# EAGLE design led_analog_watch_mvmt_v1_2 (EAGLE 6.2)
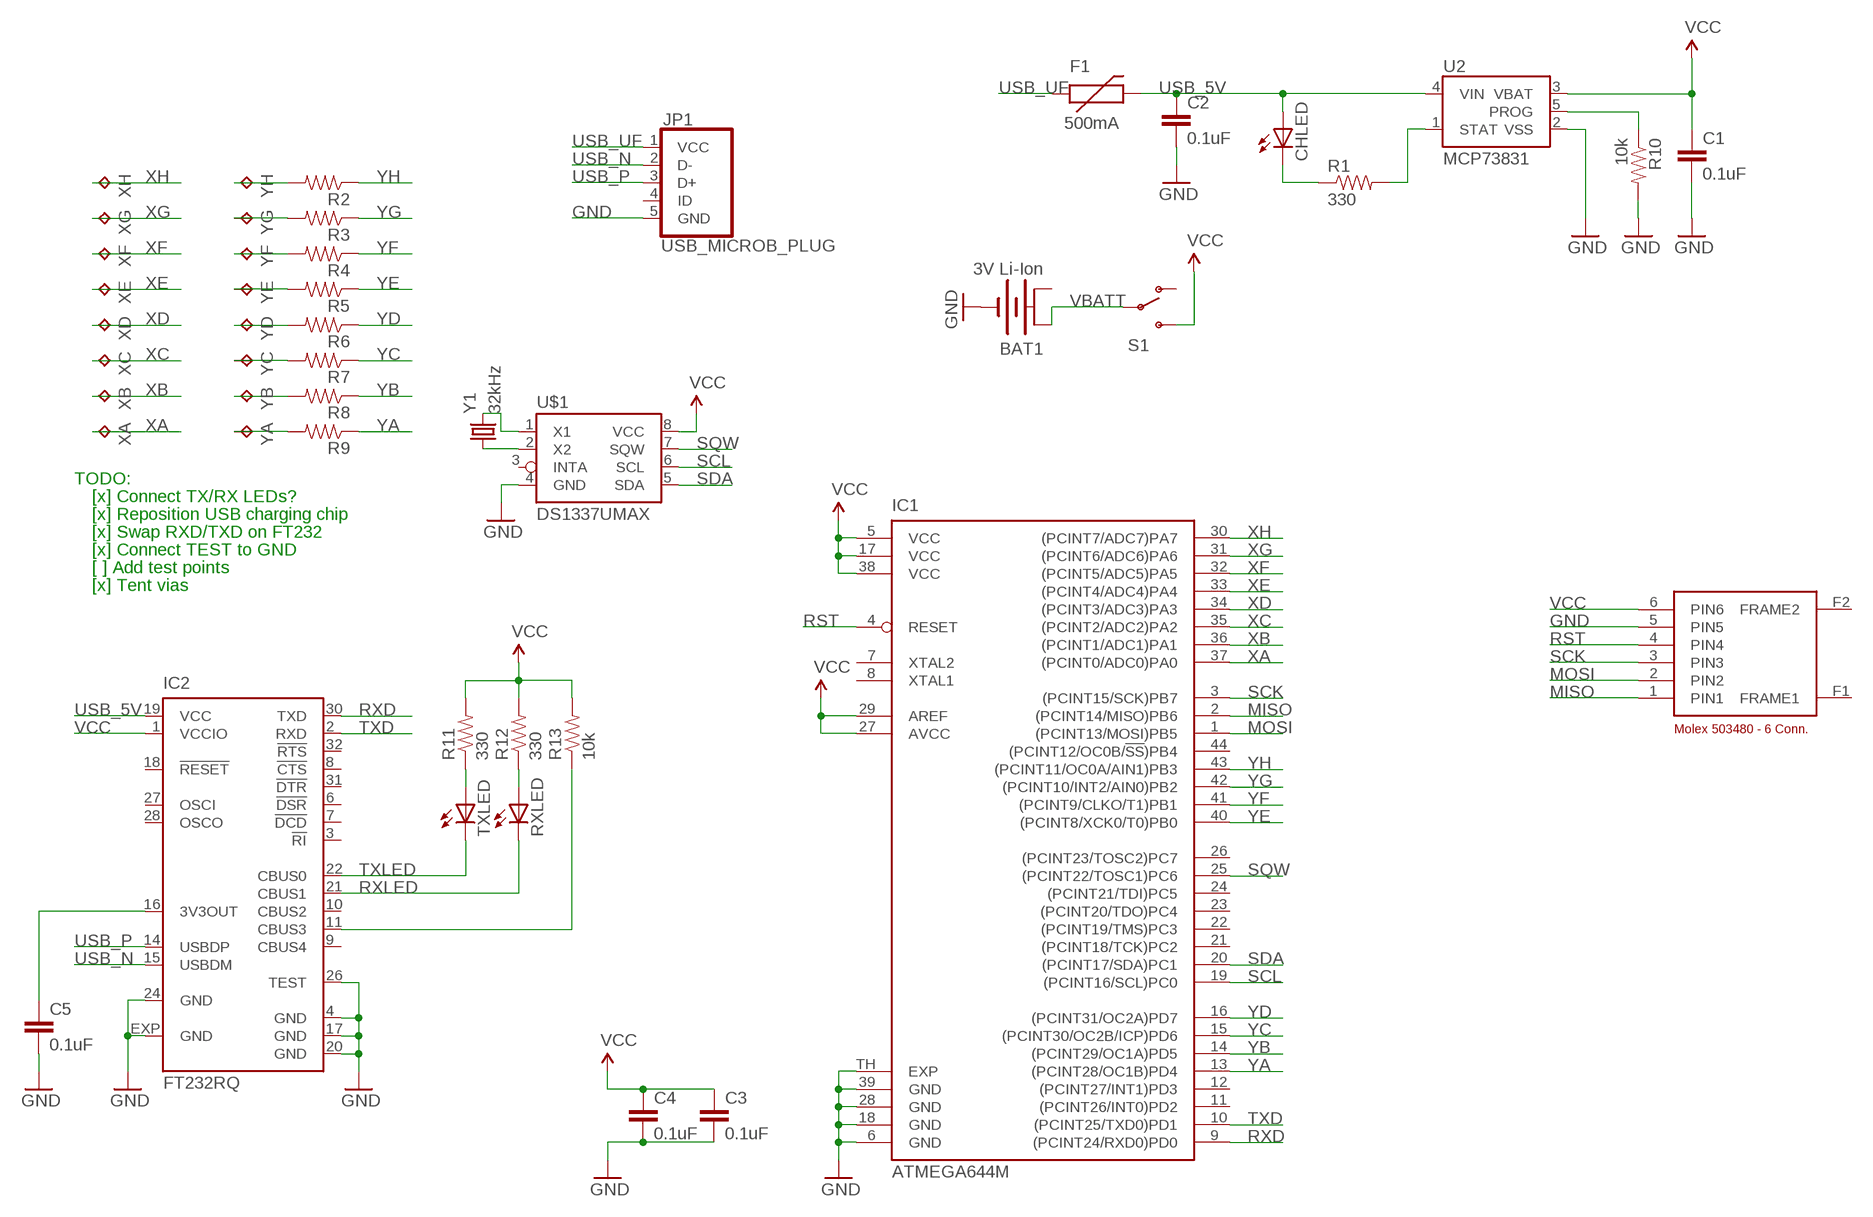
[diagram p0: schematic, sheet 1]

## Parts
BAT1  3V Li-Ion  BATTERY245PTH  [BATTCON_245MM_PTH]
C1  0.1uF  CAP-0603  [0603-CAP]
C2  0.1uF  CAP-0603  [0603-CAP]
C3  0.1uF  CAP-0603  [0603-CAP]
C4  0.1uF  CAP-0603  [0603-CAP]
C5  0.1uF  CAP-0603  [0603-CAP]
CHLED  LED-0402  [0402]
F1  500mA  PTC0603  [0603]
IC1  ATMEGA644M  [MLF44-TH]
IC2  FT232RQ  [QFN32]
JP1  USB_MICROB_PLUG  [USB_MICRO_B_TYCO]
R1  330  RESISTOR-0603  [0603]
R2  RESISTOR-0603  [0603]
R3  RESISTOR-0603  [0603]
R4  RESISTOR-0603  [0603]
R5  RESISTOR-0603  [0603]
R6  RESISTOR-0603  [0603]
R7  RESISTOR-0603  [0603]
R8  RESISTOR-0603  [0603]
R9  RESISTOR-0603  [0603]
R10  10k  RESISTOR-0603  [0603]
R11  330  RESISTOR-0603  [0603]
R12  330  RESISTOR-0603  [0603]
R13  10k  RESISTOR-0603  [0603]
RXLED  LED-0402  [0402]
S1  SWITCH-SPSTMA12R  [SWITCH-MA12R]
TXLED  LED-0402  [0402]
U2  MCP73831  [SOT23-5]
U$1  DS1337UMAX  [UMAX8]
U$2  MOLEX_503480  [MOLEX_503480]
XA  TPTP20R  [TP20R]
XB  TPTP20R  [TP20R]
XC  TPTP20R  [TP20R]
XD  TPTP20R  [TP20R]
XE  TPTP20R  [TP20R]
XF  TPTP20R  [TP20R]
XG  TPTP20R  [TP20R]
XH  TPTP20R  [TP20R]
Y1  32kHz  CRYSTALABS10  [CRYSTAL-ABS10-SMD]
YA  TPTP20R  [TP20R]
YB  TPTP20R  [TP20R]
YC  TPTP20R  [TP20R]
YD  TPTP20R  [TP20R]
YE  TPTP20R  [TP20R]
YF  TPTP20R  [TP20R]
YG  TPTP20R  [TP20R]
YH  TPTP20R  [TP20R]

## Nets
GND: BAT1.2(-) C1.2 C2.2 C3.2 C4.2 C5.2 IC1.6(GND) IC1.18(GND) IC1.28(GND) IC1.39(GND) IC1.TH(EXP) IC2.4(GND) IC2.17(GND) IC2.20(GND) IC2.24(GND) IC2.26(TEST) IC2.EXP(GND) JP1.5(GND) R10.2 U2.2(VSS) U$1.4(GND) U$2.5(PIN5)
MISO: IC1.2((PCINT14/MISO)PB6) U$2.1(PIN1)
MOSI: IC1.1((PCINT13/MOSI)PB5) U$2.2(PIN2)
N$1: R1.2 U2.1(STAT)
N$2: R10.1 U2.5(PROG)
N$3: R2.2 YH.TP
N$4: R3.2 YG.TP
N$5: R4.2 YF.TP
N$6: R5.2 YE.TP
N$7: R6.2 YD.TP
N$8: R7.2 YC.TP
N$9: R8.2 YB.TP
N$10: R9.2 YA.TP
N$11: CHLED.2(C) R1.1
N$12: IC2.11(CBUS3) R13.1
N$13: R12.1 RXLED.1(A)
N$14: U$1.2(X2) Y1.X1
N$15: U$1.1(X1) Y1.X2
N$16: R11.1 TXLED.1(A)
N$18: C5.1 IC2.16(3V3OUT)
RST: IC1.4(RESET) U$2.4(PIN4)
RXD: IC1.9((PCINT24/RXD0)PD0) IC2.30(TXD)
RXLED: IC2.21(CBUS1) RXLED.2(C)
SCK: IC1.3((PCINT15/SCK)PB7) U$2.3(PIN3)
SCL: IC1.19((PCINT16/SCL)PC0) U$1.6(SCL)
SDA: IC1.20((PCINT17/SDA)PC1) U$1.5(SDA)
SQW: IC1.25((PCINT22/TOSC1)PC6) U$1.7(SQW)
TXD: IC1.10((PCINT25/TXD0)PD1) IC2.2(RXD)
TXLED: IC2.22(CBUS0) TXLED.2(C)
USB_5V: C2.1 CHLED.1(A) F1.2 IC2.19(VCC) U2.4(VIN)
USB_N: IC2.15(USBDM) JP1.2(D-)
USB_P: IC2.14(USBDP) JP1.3(D+)
USB_UF: F1.1 JP1.1(VCC)
VBATT [supply]: BAT1.3(+A) S1.2(P)
VCC: C1.1 C3.1 C4.1 IC1.5(VCC) IC1.17(VCC) IC1.27(AVCC) IC1.29(AREF) IC1.38(VCC) IC2.1(VCCIO) R11.2 R12.2 R13.2 S1.3(S) U2.3(VBAT) U$1.8(VCC) U$2.6(PIN6)
XA: IC1.37((PCINT0/ADC0)PA0) XA.TP
XB: IC1.36((PCINT1/ADC1)PA1) XB.TP
XC: IC1.35((PCINT2/ADC2)PA2) XC.TP
XD: IC1.34((PCINT3/ADC3)PA3) XD.TP
XE: IC1.33((PCINT4/ADC4)PA4) XE.TP
XF: IC1.32((PCINT5/ADC5)PA5) XF.TP
XG: IC1.31((PCINT6/ADC6)PA6) XG.TP
XH: IC1.30((PCINT7/ADC7)PA7) XH.TP
YA: IC1.13((PCINT28/OC1B)PD4) R9.1
YB: IC1.14((PCINT29/OC1A)PD5) R8.1
YC: IC1.15((PCINT30/OC2B/ICP)PD6) R7.1
YD: IC1.16((PCINT31/OC2A)PD7) R6.1
YE: IC1.40((PCINT8/XCK0/T0)PB0) R5.1
YF: IC1.41((PCINT9/CLKO/T1)PB1) R4.1
YG: IC1.42((PCINT10/INT2/AIN0)PB2) R3.1
YH: IC1.43((PCINT11/OC0A/AIN1)PB3) R2.1
Unconnected: IC1.7(XTAL2) IC1.8(XTAL1) IC1.11((PCINT26/INT0)PD2) IC1.12((PCINT27/INT1)PD3) IC1.21((PCINT18/TCK)PC2) IC1.22((PCINT19/TMS)PC3) IC1.23((PCINT20/TDO)PC4) IC1.24((PCINT21/TDI)PC5) IC1.26((PCINT23/TOSC2)PC7) IC1.44((PCINT12/OC0B/!SS!)PB4) IC2.3(!RI) IC2.6(!DSR) IC2.7(!DCD) IC2.8(!CTS) IC2.9(CBUS4) IC2.10(CBUS2) IC2.18(!RESET) IC2.27(OSCI) IC2.28(OSCO) IC2.31(!DTR) IC2.32(!RTS) JP1.4(ID) S1.1(O) U$1.3(INTA) U$2.F1(FRAME1) U$2.F2(FRAME2)

## Notes on the sheet
- TODO:
- [x] Connect TX/RX LEDs?
- [x] Reposition USB charging chip
- [x] Swap RXD/TXD on FT232
- [x] Connect TEST to GND
- [ ] Add test points
- [x] Tent vias

## Power pins joined to a net without a drawn wire
+B: BAT1.1(+B)

## Library data of the parts
BAT1 = jcole:BATTERY: Battery Holders Various common sizes : AA, AAA, 20mm coin cell and 12mm coin cell.
C1-C5 = jcole:CAP: Capacitor Standard 0603 ceramic capacitor, and 0.1" leaded capacitor.
CHLED RXLED TXLED = jcole:LED: LEDs Standard schematic elements and footprints for 5mm, 3mm, 1206, and 0603 sized LEDs. 5mm - Spark Fun Electronics SKU : COM-00529 (and others)
F1 = SparkFun:PTC: Resettable Fuse PTC Resettable Fuse. Spark Fun Electronics SKU : COM-08357
IC1 = atmel:ATMEGA644*: 8-bit Microcontroller with 64K Bytes In-System Programmable Flash Source: http://www.atmel.com/dyn/resources/prod_documents/doc2593.pdf; MPN: ATMEGA644P-20MU; OC_FARNELL: 1748528; OC_NEWARK: 26R5636
IC2 = jcole:FT232R: Source: http://www.ftdichip.com/Documents/DataSheets/DS_FT232R_v104.pdf; MPN: FT232RQ; OC_FARNELL: 1146033; OC_NEWARK: 91K9919
JP1 = jcole:USB_MICROB_PLUG: USB Micro-B Plug Comes in a variety of packages. Check out Hirose's ZX-x0 line: http://www.hirose.co.jp/cataloge_hp/e24200011.pdf
R1-R13 = jcole:RESISTOR: Resistor Basic schematic elements and footprints for 0603, 1206, and PTH resistors.
S1 = jcole:SWITCH-SPST: SPST Switch Simple slide switch. Spark Fun Electronics SKU : COM-00102
U2 = SparkFun:MCP73831: Microchip's MCP73831 Miniature single cell, fully integrated Li-Ion, Li-polymer charge management controller http://ww1.microchip.com/downloads/en/DeviceDoc/21984a.pdf
U$1 = jcole:DS1337
U$2 = jcole:MOLEX_503480
XA XB XC XD XE XF XG XH YA YB YC YD YE YF YG YH = testpad:TP: Test pad
Y1 = jcole:CRYSTAL: Crystals Various standard crystals. Proven footprints. Spark Fun Electronics SKU : COM-00534

## Net classes
0 signal: width 0.203 mm
1 supply: width 0.305 mm

## Board
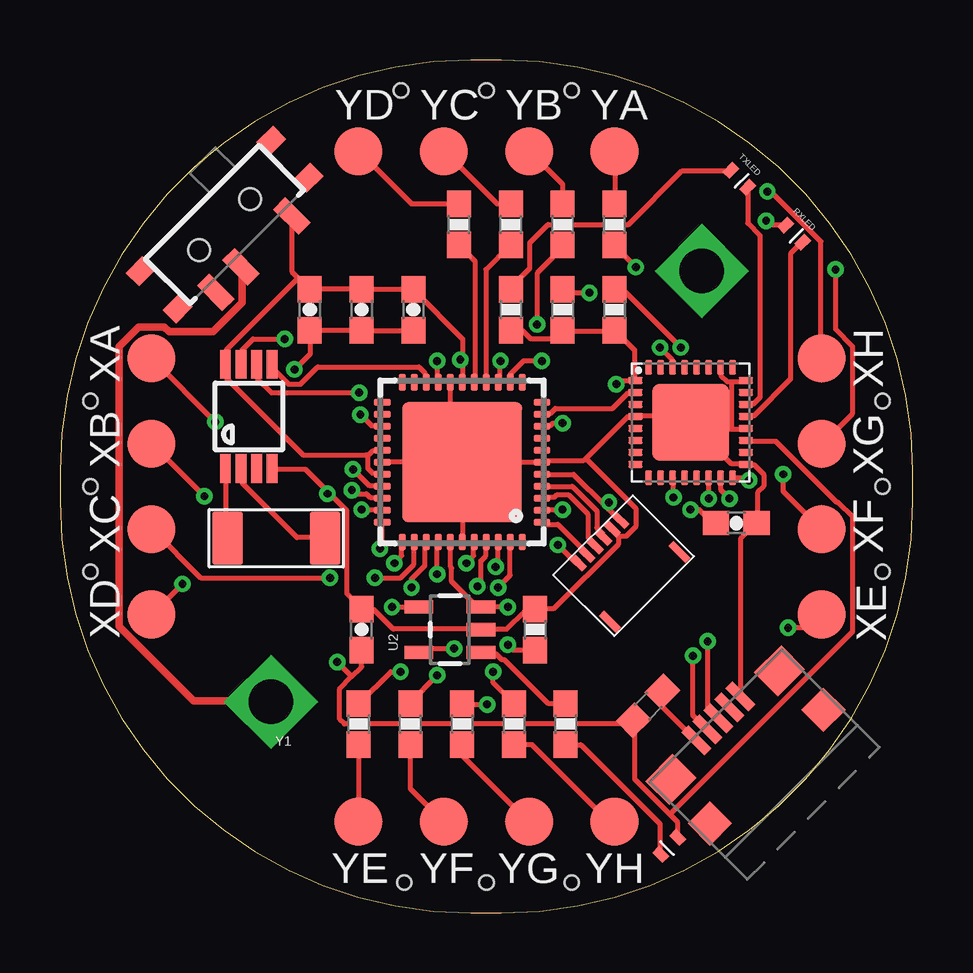
[diagram p1: board, top side]
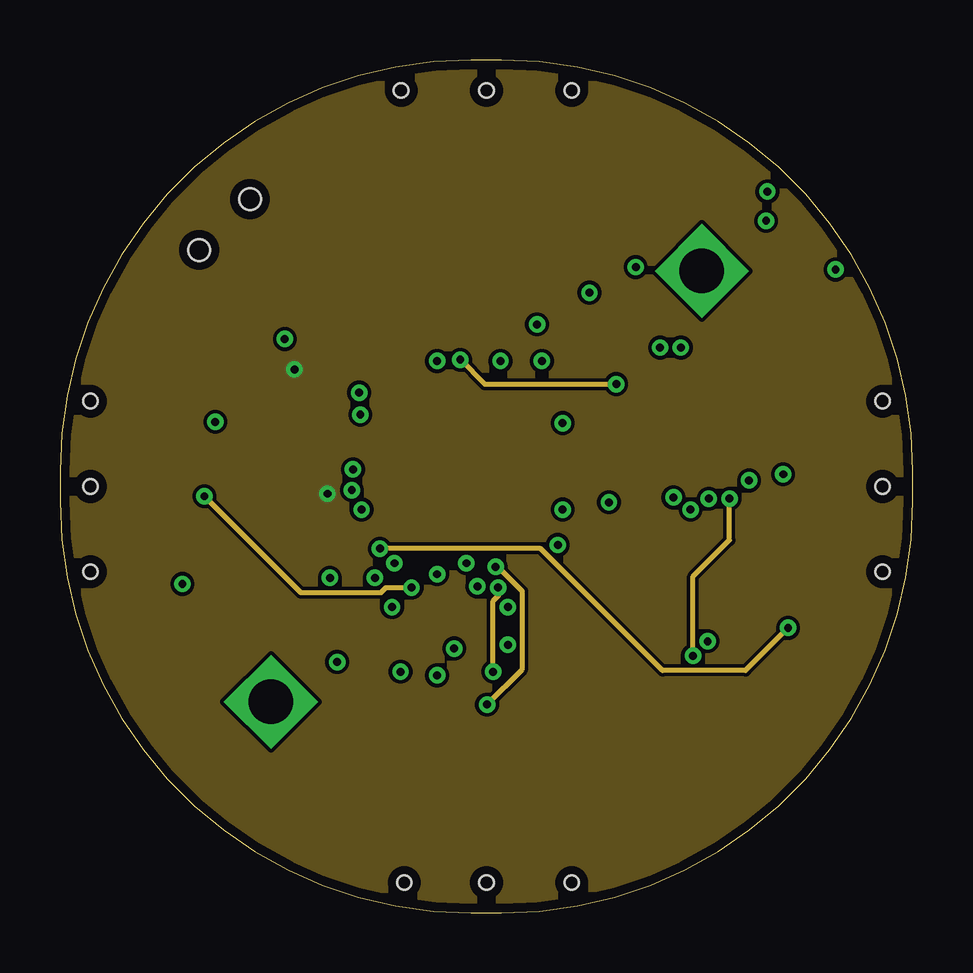
[diagram p2: board, inner layer GND]
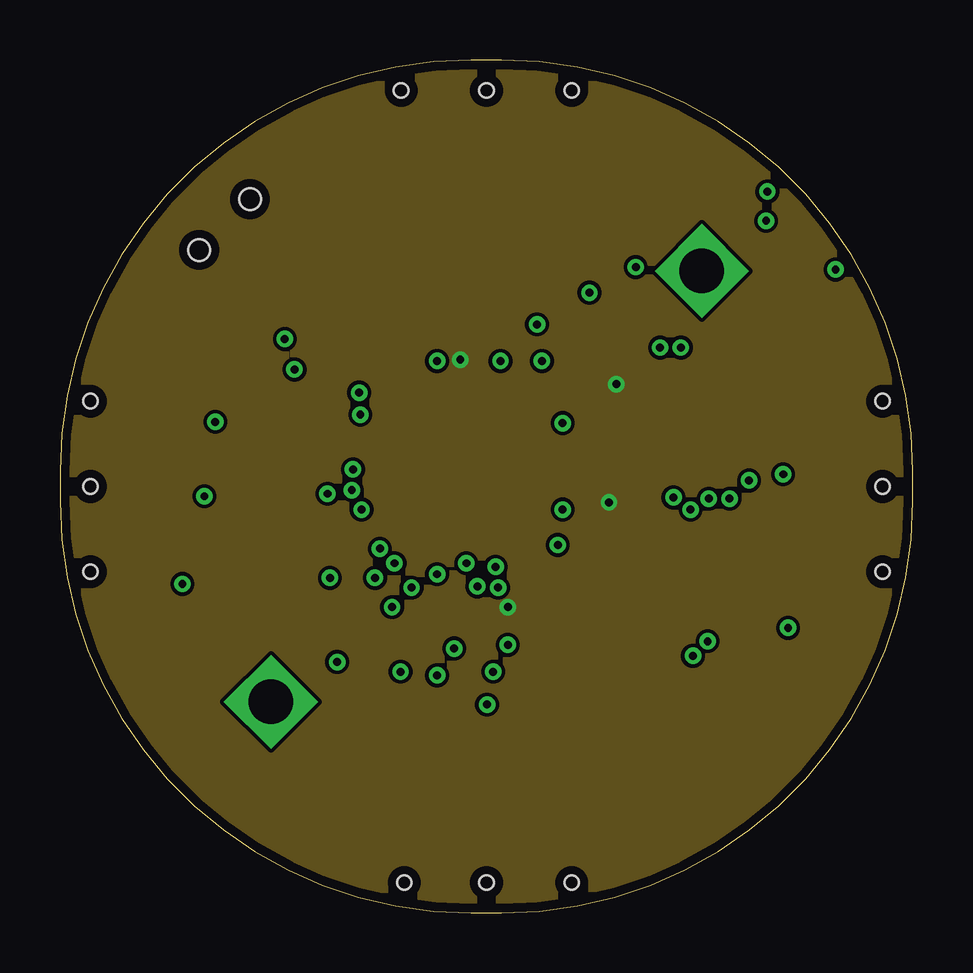
[diagram p3: board, inner layer VCC]
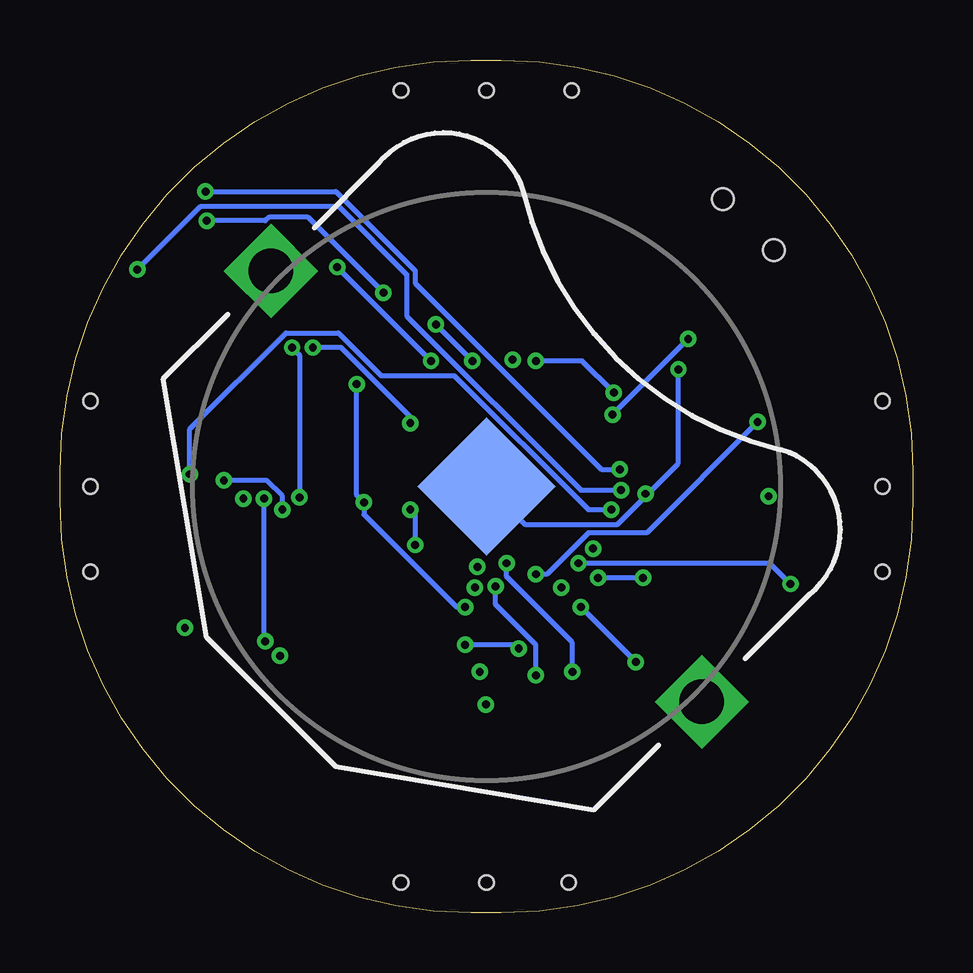
[diagram p4: board, bottom side, seen from below]

Size 35.56 x 35.56 mm. Coordinates in mm from the lower left corner, seen from the top.
Outline: 18.42,0 arc90 35.56,17.14 35.56,18.41 arc90 18.42,35.56 17.14,35.56 arc90 0,18.41 0,17.14 arc90 17.14,0 18.42,0
Copper layers (1*2+15*16): Top 0.0356mm / dielectric 1.5011mm / GND 0.0356mm / dielectric 0.1499mm / VCC 0.0356mm / dielectric 0.2007mm / Bottom 0.0356mm
Design rules: minimum track width 6mil, minimum drill 13mil, track to track 6mil, track to pad 6mil, pad to pad 6mil, via to via 6mil, smd to smd 6mil, copper to edge 15mil, drill to drill 6mil, minimum pad ring 7mil, minimum via ring 7mil, stop-mask expansion 4mil, vias tented up to drill 25mil, thermal gap 10mil
Holes 0.6 mm at 17.78,1.27 34.29,17.78 1.27,17.78 17.78,34.29 34.29,14.22 34.29,21.34 21.34,1.27 14.35,1.27 1.27,14.22 1.27,21.34 14.22,34.29 21.34,34.29
tKeepout: area 1.3,11.2 to 2.7,24.1; area 33,11.3 to 34.4,24.3; area 11.3,33 to 24.3,34.4; area 11.3,1.1 to 24.3,2.5
tRestrict: area 3.6,25.8 to 9.9,32
vRestrict: area 7.7,14.5 to 10.3,16.8

### Footprints (pad centres in the part's own frame; a part is rotated, then mirrored left to right if it is on the bottom)
BATTCON_245MM_PTH = drill 1.854 square: 1 -12.7,0; 3 12.7,0 | smd 4.064 x 4.064: 2 0,0
0603-CAP = smd 1.1 x 1: 1 -0.85,0; 2 0.85,0
0402 = smd 0.6 x 0.4: 1 0,-0.5; 2 0,0.5
0603 = smd 1.1 x 1: 1 -0.85,0; 2 0.85,0
MLF44-TH = smd 0.7 x 0.3: 1 -3.325,2.5; 2 -3.325,2; 3 -3.325,1.5; 4 -3.325,1; 5 -3.325,0.5; 6 -3.325,0; 7 -3.325,-0.5; 8 -3.325,-1; 9 -3.325,-1.5; 10 -3.325,-2; 11 -3.325,-2.5; 23 3.325,-2.5; 24 3.325,-2; 25 3.325,-1.5; 26 3.325,-1; 27 3.325,-0.5; 28 3.325,0; 29 3.325,0.5; 30 3.325,1; 31 3.325,1.5; 32 3.325,2; 33 3.325,2.5 | smd 0.3 x 0.7: 12 -2.5,-3.325; 13 -2,-3.325; 14 -1.5,-3.325; 15 -1,-3.325; 16 -0.5,-3.325; 17 0,-3.325; 18 0.5,-3.325; 19 1,-3.325; 20 1.5,-3.325; 21 2,-3.325; 22 2.5,-3.325; 34 2.5,3.325; 35 2,3.325; 36 1.5,3.325; 37 1,3.325; 38 0.5,3.325; 39 0,3.325; 40 -0.5,3.325; 41 -1,3.325; 42 -1.5,3.325; 43 -2,3.325; 44 -2.5,3.325 | smd 5 x 5: TH 0,0
QFN32 = smd 0.6 x 0.3: 1 -2.3,1.75; 2 -2.3,1.25; 3 -2.3,0.75; 4 -2.3,0.25; 5 -2.3,-0.25; 6 -2.3,-0.75; 7 -2.3,-1.25; 8 -2.3,-1.75; 17 2.3,-1.75; 18 2.3,-1.25; 19 2.3,-0.75; 20 2.3,-0.25; 21 2.3,0.25; 22 2.3,0.75; 23 2.3,1.25; 24 2.3,1.75 | smd 0.3 x 0.6: 9 -1.75,-2.3; 10 -1.25,-2.3; 11 -0.75,-2.3; 12 -0.25,-2.3; 13 0.25,-2.3; 14 0.75,-2.3; 15 1.25,-2.3; 16 1.75,-2.3; 25 1.75,2.3; 26 1.25,2.3; 27 0.75,2.3; 28 0.25,2.3; 29 -0.25,2.3; 30 -0.75,2.3; 31 -1.25,2.3; 32 -1.75,2.3 | smd 3.2 x 3.2: EXP 0,0
USB_MICRO_B_TYCO = smd 0.4 x 1.35: 1 -1.3,2.85; 2 -0.65,2.85; 3 0,2.85; 4 0.65,2.85; 5 1.3,2.85 | smd 1.3 x 1.3: SH@1 3.35,0; SH@2 -3.35,0 | smd 1.6 x 1.4: SH@3 3.2,2.45; SH@4 -3.2,2.45
SWITCH-MA12R = smd 0.711 x 1.499: 1 -2.261,-1.74; 2 -0.762,-1.74; 3 2.235,-1.74 | smd 0.991 x 0.787: 4 3.848,-1.092; 5 -3.848,-1.092; 6 -3.848,1.092; 7 3.848,1.092 | hole 0.9: -1.499,0; 1.499,0
SOT23-5 = smd 0.55 x 1.2: 1 -0.95,-1.3; 2 0,-1.3; 3 0.95,-1.3; 4 0.95,1.3; 5 -0.95,1.3
UMAX8 = smd 0.45 x 1.2: 1 -0.975,-2.175; 2 -0.325,-2.175; 3 0.325,-2.175; 4 0.975,-2.175; 5 0.975,2.175; 6 0.325,2.175; 7 -0.325,2.175; 8 -0.975,2.175
MOLEX_503480 = smd 0.3 x 0.7: 1 -1.25,1.4; 2 -0.75,1.4; 3 -0.25,1.4; 4 0.25,1.4; 5 0.75,1.4; 6 1.25,1.4 | smd 0.3 x 1: F1 -2.05,-1.25; F2 2.05,-1.25
TP20R = smd 2 x 2: TP 0,0
CRYSTAL-ABS10-SMD = smd 1.27 x 2.21: X1 -2.032,0; X2 2.032,0

### Placement (x,y rotation side)
BAT1  17.78,17.78 315 bottom
C1  14.73,25.15 270 top
C2  12.57,11.81 90 top
C3  10.41,25.15 270 top
C4  12.57,25.15 270 top
C5  28.19,16.26 0 top
CHLED  25.4,2.79 135 top
F1  24.51,8.64 225 top
IC1  16.76,18.8 180 top
IC2  26.29,20.45 0 top
JP1  29.46,6.1 45 top
R1  21.08,7.87 90 top
R2  18.92,7.87 270 top
R3  16.76,7.87 270 top
R4  14.6,7.87 270 top
R5  12.45,7.87 270 top
R6  16.64,28.7 90 top
R7  18.8,28.7 90 top
R8  20.96,28.7 90 top
R9  23.11,28.7 90 top
R10  19.81,11.81 90 top
R11  18.8,25.15 270 top
R12  20.96,25.15 270 top
R13  23.11,25.15 270 top
RXLED  30.61,28.32 225 top
S1  6.86,28.7 45 top
TXLED  28.32,30.61 225 top
U2  16.26,11.81 90 top
U$1  7.87,20.7 0 top
U$2  23.5,14.48 45 top
XA  3.81,23.11 0 top
XB  3.81,19.56 0 top
XC  3.81,16 0 top
XD  3.81,12.45 0 top
XE  31.75,12.45 0 top
XF  31.75,16 0 top
XG  31.75,19.56 0 top
XH  31.75,23.11 0 top
Y1  9.02,15.62 180 top
YA  23.11,31.75 270 top
YB  19.56,31.75 270 top
YC  16,31.75 270 top
YD  12.45,31.75 270 top
YE  12.45,3.81 270 top
YF  16,3.81 270 top
YG  19.56,3.81 270 top
YH  23.11,3.81 270 top

### Tracks (layer width: path | path; a pad name or v marks a point on that pad's centre or on a via)
GND  (via drill 0.33)
  Top 0.203: C1.2 14.71,24.28 12.62,24.28 C4.2 12.57,24.28 10.44,24.28 C3.2 10.44,24.18 10.44,23.32 v9.78,22.66 | 23.29,15.7 23.04,15.95 U$2.5 | 23.29,15.7 23.29,15.39 20.6,12.7 19.84,12.7 R10.2 19.74,12.6 19.38,12.6 18.62,11.84 17.65,11.84 U2.2 17.55,11.84 13.89,11.84 13.08,12.65 12.57,12.65 C2.2 12.52,12.75 11.96,13.31 11.96,16.76 11.2,17.53 | 11.2,17.53 10.24,18.49 8.87,18.49 U$1.4 | v11.15,17.48 11.2,17.53 | 16.28,22.15 IC1.18 16.28,22.05 16.28,18.85 IC1.TH | IC1.28 IC1.TH | 16.79,15.49 IC1.39 16.79,15.6 16.79,18.8 IC1.TH | IC1.TH IC1.6 20.14,18.85 21.82,18.85 21.92,18.95 | 28.02,22.15 27.81,22.15 27.56,22.4 27.56,22.71 IC2.26 | 28.02,22.15 28.58,22.15 IC2.24 | 24,20.73 IC2.4 | 28.63,18.69 IC2.17 | IC2.17 28.52,18.75 27.96,18.75 26.29,20.42 IC2.EXP | IC2.4 24.11,20.73 26.04,20.73 26.24,20.52 IC2.EXP | 28.02,20.17 26.64,20.17 IC2.EXP | 28.02,20.17 28.58,20.17 IC2.20 | IC2.17 28.73,18.69 28.93,18.69 29.34,18.29 29.34,17.78 29.08,17.53 29.08,16.26 C5.2 28.98,16.2 28.37,15.6 28.37,9.04 JP1.5 | 28.02,20.17 28.02,22.15 | 26.29,20.47 IC2.EXP | 21.92,18.95 23.65,20.68 23.9,20.68 IC2.4 | 23.29,15.7 23.6,15.7 24,16.1 24,16.87 21.92,18.95
  Bottom 0.203: v9.78,22.66 9.78,18.75 11.1,17.42 | 11.1,17.42 12.32,16.2 16.18,16.2 17.76,17.78 BAT1.2 | v11.15,17.48 11.1,17.42
  pour GND: -0.13,0 35.43,0 35.43,35.56 -0.13,35.56
MISO  (via drill 0.33)
  Top 0.203: v20.75,15.34 21.46,14.63 21.62,14.63 U$2.1 | v20.96,16.82 20.09,16.82 IC1.2
  Bottom 0.203: v20.75,15.34 20.75,16.61 v20.96,16.82
MOSI
  Top 0.203: U$2.2 21.97,14.99 20.75,16.2 20.14,16.2 20.09,16.26 IC1.1
N$1
  Top 0.203: R1.2 21.06,8.74 20.35,8.74 18.52,10.57 18.42,10.57 18.16,10.82 17.6,10.82 U2.1
N$2  (via drill 0.33)
  Top 0.203: v18.67,11.18 18.87,10.97 19.79,10.97 R10.1 | v16.43,11.02 15.11,11.02 14.96,10.87 U2.5
  Bottom 0.203: v18.67,11.18 16.59,11.18 v16.43,11.02
N$3
  Top 0.203: YH.TP 22.89,3.81 19.69,7.01 R2.2
N$4
  Top 0.203: R3.2 16.79,7.01 16.79,6.55 19.53,3.81 YG.TP
N$5
  Top 0.203: R4.2 14.6,5.18 15.98,3.81 YF.TP
N$6
  Top 0.203: R5.2 12.47,7.01 12.47,3.81 YE.TP
N$7
  Top 0.203: R6.2 16.64,29.57 14.66,29.57 12.47,31.75 YD.TP
N$8
  Top 0.203: R7.2 18.77,29.57 18.21,29.57 16.03,31.75 YC.TP
N$9
  Top 0.203: R8.2 20.96,30.38 19.58,31.75 YB.TP
N$10
  Top 0.203: R9.2 23.14,29.57 23.14,31.75 YA.TP
N$11
  Top 0.203: CHLED.2 25.02,2.49 25.02,3.71 21.72,7.01 21.11,7.01 R1.1
N$12  (via drill 0.33)
  Top 0.203: v25.58,17.32 25.58,18.14 IC2.11 | v25.88,23.57 23.5,25.96 23.14,25.96 R13.1
  Bottom 0.203: v25.58,17.32 25.58,23.27 v25.88,23.57
N$13  (via drill 0.33)
  Top 0.203: v29.44,28.85 29.59,28.7 30.25,28.7 RXLED.1 | v22.07,25.86 21.06,25.86 20.96,25.96 R12.1
  Bottom 0.203: v29.44,28.85 27,28.85 26.85,29.01 25.22,29.01 v22.07,25.86
N$14
  Top 0.203: U$1.2 7.6,18.49 7.6,17.93 9.88,15.65 11.05,15.65 Y1.X1
N$15
  Top 0.203: U$1.1 6.93,18.49 6.93,15.7 6.99,15.65 Y1.X2
N$16
  Top 0.203: TXLED.1 27.96,30.94 25.93,30.94 23.7,28.7 20.35,28.7 19.58,27.94 19.58,26.87 18.82,26.11 18.82,26.01 R11.1
N$18  (via drill 0.33)
  Top 0.203: v28.73,18.03 28.63,18.14 28.07,18.14 IC2.16 | v26.29,16.82 26.64,16.82 27.2,16.26 C5.1
  Bottom 0.203: v28.73,18.03 26.95,18.03 26.29,17.37 v26.29,16.82
RST
  Top 0.203: U$2.4 22.63,15.65 22.63,15.8 22.38,16.05 22.38,16.76 21.36,17.78 20.09,17.78 IC1.4
RXD  (via drill 0.33)
  Top 0.203: v25.02,23.57 25.53,23.06 25.53,22.76 IC2.30 | v20.96,20.42 20.55,20.42 20.45,20.32 20.09,20.32 IC1.9
  Bottom 0.203: v25.02,23.57 23.85,23.57 20.96,20.68 v20.96,20.42
RXLED
  Top 0.203: IC2.21 28.63,20.73 28.93,20.73 30.46,22.25 30.46,27.48 30.91,27.94 RXLED.2
SCK
  Top 0.203: IC1.3 20.09,17.32 20.6,17.32 20.7,17.42 21.21,17.42 22.02,16.61 22.02,15.65 22.33,15.34 U$2.3
SCL  (via drill 0.33)
  Top 0.203: v15.72,23.01 15.72,22.15 IC1.19 | v12.47,21.69 8.81,21.69 8.2,22.3 8.2,22.86 U$1.6
  Bottom 0.203: v15.72,23.01 13.79,23.01 v12.47,21.69
SDA
  Top 0.203: IC1.20 15.21,22.15 15.21,22.5 14.96,22.76 10.74,22.76 10.03,22.05 9.52,22.05 8.87,22.71 8.87,22.86 U$1.5
SQW  (via drill 0.33)
  Top 0.203: v12.52,20.78 12.98,20.32 13.44,20.32 IC1.25 | v9.37,23.93 8.05,23.93 7.6,23.47 7.6,22.91 U$1.7
  Bottom 0.203: v9.37,23.93 v12.52,20.78
TXD
  Top 0.203: IC2.2 23.95,21.69 23.7,21.69 23.04,21.03 20.65,21.03 20.45,20.83 20.09,20.83 IC1.10
TXLED
  Top 0.203: IC2.22 28.63,21.23 28.93,21.23 29.19,21.49 29.19,28.25 28.68,28.75 28.68,30.23 TXLED.2
USB_5V  (via drill 0.33)
  Top 0.203: 25.43,4.12 23.95,5.59 23.95,8.03 F1.2 23.9,7.87 11.86,7.87 11.66,8.08 11.66,9.35 12.17,9.86 | 25.43,4.12 25.73,3.81 25.73,3.15 CHLED.1 | 25.43,4.12 33.04,11.73 33.04,16.51 32.44,17.12 32.38,17.12 29.85,19.66 28.63,19.66 IC2.19 | C2.1 12.57,10.26 12.17,9.86 | v13.84,12.75 14.91,12.75 U2.4 | 12.17,9.86 v11.56,10.46
  Bottom 0.203: v11.56,10.46 v13.84,12.75
USB_N  (via drill 0.33)
  Top 0.203: v27.92,17.27 27.56,17.63 27.56,18.14 IC2.15 | v26.39,10.72 26.39,8.23 26.95,7.67 JP1.2
  GND 0.203: v27.92,17.27 27.92,15.54 26.39,14.02 v26.39,10.72
USB_P  (via drill 0.33)
  Top 0.203: v27.05,17.27 27.05,18.14 IC2.14 | v27,11.33 27,8.53 27.41,8.13 JP1.3
  Bottom 0.203: v27.05,17.27 27.05,11.38 v27,11.33
USB_UF
  Top 0.203: F1.1 25.12,9.2 25.12,8.59 26.49,7.21 JP1.1
VBATT
  Top 0.305: S1.2 7.6,26.92 7.6,25.45 6.38,24.23 4.55,24.23 4.34,24.43 3.28,24.43 2.46,23.62 2.46,11.94 5.56,8.84 8.76,8.84 BAT1.3
VCC  (via drill 0.33)
  Top 0.203: R11.2 18.82,24.28 19.28,24.28 19.63,23.93 20.6,23.93 20.96,24.28 R12.2 21.01,24.23 23.04,24.23 R13.2 23.14,24.28 23.95,23.47 23.95,22.2 IC2.1 23.85,22.2 23.34,22.2 v23.19,22.05 | 16.28,15.49 IC1.38 16.28,15.39 16.28,14.43 16.33,14.38 16.33,13.82 17.35,12.8 17.55,12.8 U2.3 17.65,12.75 v18.67,12.75 | 22.73,16.97 21.41,18.29 20.09,18.29 IC1.5 | 22.73,16.97 23.34,16.36 U$2.6 | 22.73,16.97 v22.89,17.12 | 12.83,19.05 12.83,18.54 13.03,18.34 13.44,18.34 IC1.29 | 12.83,19.05 13.03,19.25 13.44,19.25 IC1.27 | 12.83,19.05 12.78,19.1 10.13,19.1 6.93,22.3 6.93,22.86 U$1.8 6.93,22.96 6.93,23.47 9.93,26.47 | 16.79,22.15 IC1.17 16.79,22.25 16.79,23.06 | 16.79,23.06 16.79,23.93 14.76,25.96 C1.1 14.66,26.01 12.62,26.01 C4.1 10.44,26.01 C3.1 10.34,26.06 9.93,26.47 | 9.93,26.47 9.68,26.72 9.68,29.01 S1.3 | v16.69,23.06 16.79,23.06
  GND 0.203: v23.19,22.05 17.7,22.05 v16.69,23.06
  Bottom 0.203: v18.67,12.75 19.03,12.75 22.89,16.61 v22.89,17.12 23.19,17.42 v23.19,22.05
  pour VCC: -0.13,0 35.43,0 35.43,35.56 -0.13,35.56
XA  (via drill 0.33)
  Top 0.203: v15.72,14.12 15.72,15.44 IC1.37 | v6.48,20.47 3.83,23.11 XA.TP
  Bottom 0.203: v15.72,14.12 15.26,14.12 13.54,15.85 11.1,15.85 v6.48,20.47
XB  (via drill 0.33)
  Top 0.203: v14.66,13.56 14.66,13.92 15.21,14.48 15.21,15.44 IC1.36 | v6.02,17.37 3.83,19.56 XB.TP
  GND 0.203: v14.66,13.56 13.59,13.56 13.39,13.36 10.03,13.36 v6.02,17.37
XC  (via drill 0.33)
  Top 0.203: v13.13,13.97 14.2,13.97 14.76,14.53 14.76,15.44 IC1.35 | v11.25,13.97 5.87,13.97 3.83,16 XC.TP
  Bottom 0.203: v11.25,13.97 v13.13,13.97
XD  (via drill 0.33)
  Top 0.203: v13.94,14.58 14.25,14.88 14.25,15.44 IC1.34 | v5.11,13.72 3.83,12.45 XD.TP
  Bottom 0.203: v13.94,14.58 5.97,14.58 v5.11,13.72
XE  (via drill 0.33)
  Top 0.203: v13.33,15.19 13.44,15.29 13.44,16.26 IC1.33 | v30.35,11.89 31.17,11.89 31.73,12.45 XE.TP
  GND 0.203: v13.33,15.19 20.04,15.19 25.12,10.11 28.58,10.11 v30.35,11.89
XF  (via drill 0.33)
  Top 0.203: v12.57,16.82 13.44,16.82 IC1.32 | v30.15,18.29 30.15,17.58 31.73,16 XF.TP
  Bottom 0.203: v12.57,16.82 13.54,16.82 19.13,22.4 22.17,22.4 23.95,24.18 26.14,24.18 30.15,20.17 v30.15,18.29
XG  (via drill 0.33)
  Top 0.203: v12.17,17.63 12.32,17.48 12.78,17.48 12.93,17.32 13.44,17.32 IC1.31 | v32.33,26.82 32.33,24.33 33.04,23.62 33.04,20.83 31.78,19.56 XG.TP
  Bottom 0.203: v12.17,17.63 13.84,17.63 21.11,24.89 21.11,26.62 23.95,29.46 29.69,29.46 v32.33,26.82
XH  (via drill 0.33)
  Top 0.203: v12.22,18.49 12.88,17.83 13.44,17.83 IC1.30 | v29.49,30.07 29.64,30.07 31.73,27.99 31.73,23.11 XH.TP
  Bottom 0.203: v12.22,18.49 12.98,18.49 20.75,26.26 20.75,26.77 24.05,30.07 v29.49,30.07
YA  (via drill 0.33)
  Top 0.203: v20.09,23.01 19.33,23.01 18.77,22.45 18.77,22.15 IC1.13 | v24,26.92 23.09,27.84 R9.1
  Bottom 0.203: v24,26.92 v20.09,23.01
YB  (via drill 0.33)
  Top 0.203: v18.36,23.01 18.31,22.96 18.31,22.15 IC1.14 | v19.89,24.54 19.89,26.67 20.96,27.74 R8.1
  Bottom 0.203: v19.89,24.54 v18.36,23.01
YC
  Top 0.203: IC1.15 17.76,22.15 17.76,26.82 18.77,27.84 R7.1
YD
  Top 0.203: IC1.16 17.3,22.15 17.3,27.18 16.64,27.84 R6.1
YE  (via drill 0.33)
  Top 0.203: v16.94,14.58 17.25,14.88 17.25,15.44 IC1.40 | v14.2,10.06 13.79,10.06 12.47,8.74 R5.1
  Bottom 0.203: v16.94,14.58 16.94,14.02 14.2,11.28 v14.2,10.06
YF  (via drill 0.33)
  Top 0.203: v17.4,13.61 17.55,13.77 17.55,14.68 17.76,14.88 17.76,15.44 IC1.41 | v15.72,9.91 14.6,8.79 R4.1
  Bottom 0.203: v17.4,13.61 17.4,12.85 15.72,11.18 v15.72,9.91
YG  (via drill 0.33)
  Top 0.203: v18.16,14.43 18.26,14.53 18.26,15.44 IC1.42 | v17.8,8.69 16.79,8.69 R3.1
  GND 0.203: v18.16,14.43 18.26,14.43 19.28,13.41 19.28,10.16 v17.8,8.69
YH  (via drill 0.33)
  Top 0.203: v18.26,13.56 18.77,14.07 18.77,15.44 IC1.43 | v18.06,10.06 18.06,9.6 18.92,8.74 R2.1
  GND 0.203: v18.26,13.56 18.26,13.21 18.06,13.01 v18.06,10.06

### Text on the board
tDocu: TX | RX | v1.2 | (c) Jeremy Cole | 2012-05-27